# Altium project Stm32 Audio.PrjPCB
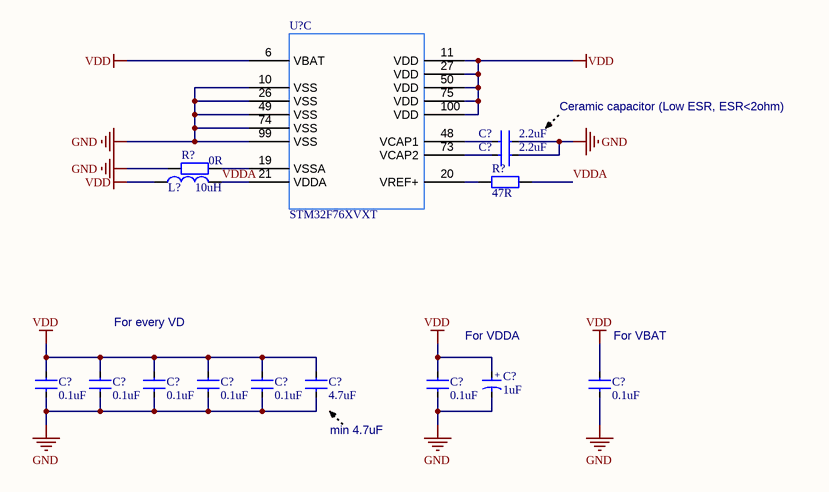
[diagram p0: Power.SchDoc]
2 sheets, 20 parts. Net scope: global (net labels, ports and power ports of the same name join across sheets).
Board file: STM32 Audio.PcbDoc
Sheets:
  Power.SchDoc
  MCU.SchDoc

## Sheet Power.SchDoc
size A4

### Parts
(Parts that share a designator on the sheet are numbered #1, #2 ... from top to bottom, then left to right.)
C?#1  2.2uF  [0805C]
C?#2  2.2uF  [0805C]
C?#3  1uF  [T-A-3216]
C?#4  0.1uF  [0603C_B]
C?#5  0.1uF  [0603C_B]
C?#6  0.1uF  [0603C_B]
C?#7  0.1uF  [0603C_B]
C?#8  0.1uF  [0603C_B]
C?#9  4.7uF  [0603C_B]
C?#10  0.1uF  [0603C_B]
C?#11  0.1uF  [0603C_B]
L?  10uH  [0805R]
R?#1  0R  [0603R_B]
R?#2  47R  [0603R_B]
U?#1  STM32F76XVXT  [LQFP-100_14X14mm]  (part C of 3)

### Nets
GND: C?#1.2 C?#2.2 C?#3.2 C?#4.2 C?#5.2 C?#6.2 C?#7.2 C?#8.2 C?#9.2 C?#10.2 C?#11.2 R?#1.1 U?#1.10(VSS) U?#1.26(VSS) U?#1.49(VSS) U?#1.74(VSS) U?#1.99(VSS)
VDD: C?#3.1 C?#4.1 C?#5.1 C?#6.1 C?#7.1 C?#8.1 C?#9.1 C?#10.1 C?#11.1 L?.2 U?#1.6(VBAT) U?#1.11(VDD) U?#1.27(VDD) U?#1.50(VDD) U?#1.75(VDD) U?#1.100(VDD)
VDDA: L?.1 R?#2.2 U?#1.21(VDDA)
NetC?#1_1: C?#1.1 U?#1.48(VCAP1)
NetC?#2_1: C?#2.1 U?#1.73(VCAP2)
NetR?#1_2: R?#1.2 U?#1.19(VSSA)
NetR?#2_1: R?#2.1 U?#1.20(VREF+)

### Notes on the sheet
- Ceramic capacitor (Low ESR, ESR<2ohm)
- (near C?#6) For every VD
- (near C?#3) For VDDA
- (near C?#11) For VBAT
- (near C?#9) min 4.7uF
- (in symbol CAP-T) +

### Library data of the parts
C?#1 C?#2 C?#4-C?#11 = CAP: 普通小电容
  C?#1 C?#2: Value: 2.2uF
  C?#4-C?#8 C?#10 C?#11: Value: 0.1uF
  C?#9: Value: 4.7uF
C?#3 = CAP-T: 钽电容; Value: 1uF
L? = L1: 普通电感; Value: 10uH
R?#1 R?#2 = RES: 普通电阻
  R?#1: Value: 0R
  R?#2: Value: 47R
U?#1 = STM32F76XVXT: Imported; Vendor: STMicroelectronics; C: Copyright (C) 2016 Accelerated Designs. All rights reserved; Manufacturer_Part_Number: stm32f76xvxt; Copyright: Copyright (C) 2016 Accelerated Designs. All rights reserved; RefDes: RefDes; Type: Type; Value: Value

## Sheet MCU.SchDoc
size A4
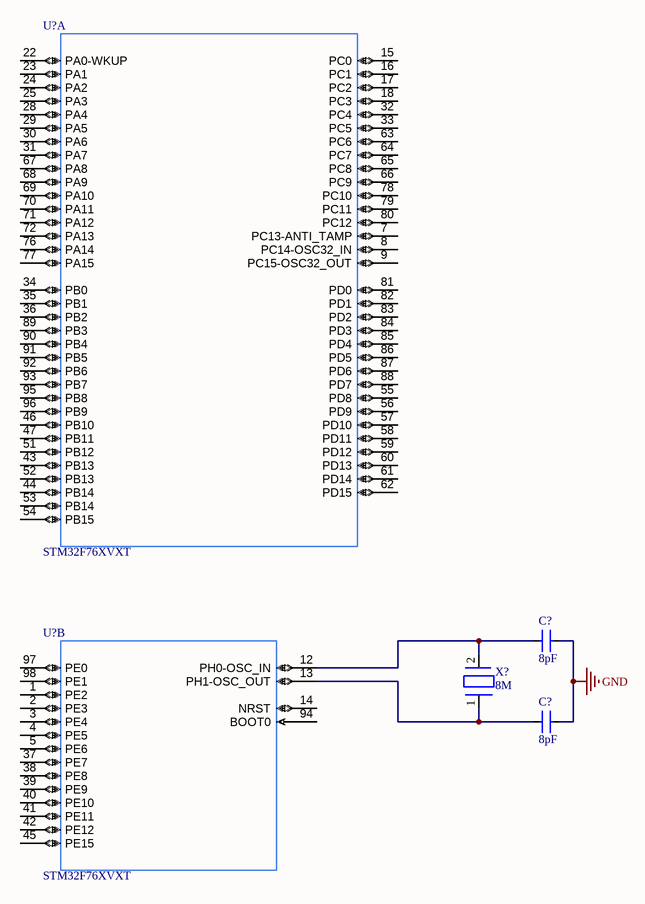
[diagram p1: MCU.SchDoc]

### Parts
(Parts that share a designator on the sheet are numbered #1, #2 ... from top to bottom, then left to right.)
C?#12  8pF  [0603C_B]
C?#13  8pF  [0603C_B]
U?#2  STM32F76XVXT  [LQFP-100_14X14mm]  (part A of 3)
U?#3  STM32F76XVXT  [LQFP-100_14X14mm]  (part B of 3)
X?  8M  [XTAL-SMD2_50X32]

### Nets
GND: C?#12.2 C?#13.2
NetC?#12_1: C?#12.1 U?#3.12(PH0-OSC_IN) X?.2
NetC?#13_1: C?#13.1 U?#3.13(PH1-OSC_OUT) X?.1

Not connected (* = marked no-connect by the designer): U?#2 7(PC13-ANTI_TAMP) 8(PC14-OSC32_IN) 9(PC15-OSC32_OUT) 15(PC0) 16(PC1) 17(PC2) 18(PC3) 22(PA0-WKUP) 23(PA1) 24(PA2) 25(PA3) 28(PA4) 29(PA5) 30(PA6) 31(PA7) 32(PC4) 33(PC5) 34(PB0) 35(PB1) 36(PB2) 43(PB13) 44(PB14) 46(PB10) 47(PB11) 51(PB12) 52(PB13) 53(PB14) 54(PB15) 55(PD8) 56(PD9) 57(PD10) 58(PD11) 59(PD12) 60(PD13) 61(PD14) 62(PD15) 63(PC6) 64(PC7) 65(PC8) 66(PC9) 67(PA8) 68(PA9) 69(PA10) 70(PA11) 71(PA12) 72(PA13) 76(PA14) 77(PA15) 78(PC10) 79(PC11) 80(PC12) 81(PD0) 82(PD1) 83(PD2) 84(PD3) 85(PD4) 86(PD5) 87(PD6) 88(PD7) 89(PB3) 90(PB4) 91(PB5) 92(PB6) 93(PB7) 95(PB8) 96(PB9); U?#3 1(PE2) 2(PE3) 3(PE4) 4(PE5) 5(PE6) 14(NRST) 37(PE7) 38(PE8) 39(PE9) 40(PE10) 41(PE11) 42(PE12) 45(PE15) 94(BOOT0) 97(PE0) 98(PE1)

### Library data of the parts
C?#12 C?#13 = CAP: 普通小电容; Value: 8pF
U?#2 U?#3 = STM32F76XVXT: as U?#1 on sheet Power; Manufacturer_Part_Number: stm32f76xvxt; Copyright: Copyright (C) 2016 Accelerated Designs. All rights reserved; RefDes: RefDes; Type: Type; Value: Value
X? = XTAL: 无源晶振

## Nets that join several sheets
GND: Power (17 pins), MCU (C?#12.2 C?#13.2)